# Altium schematic sheet sb-sonata-debug.SchDoc: FTDI Interface (Debug Programming)
size Letter; Organization: NewAE Technology Inc.; Address1: 1083 Queen St., Suite 196; Address2: Halifax; Address3: NS; Address4: Canada B3H 0B2; SheetNumber: 7; SheetTotal: 20; SheetApproved: NO
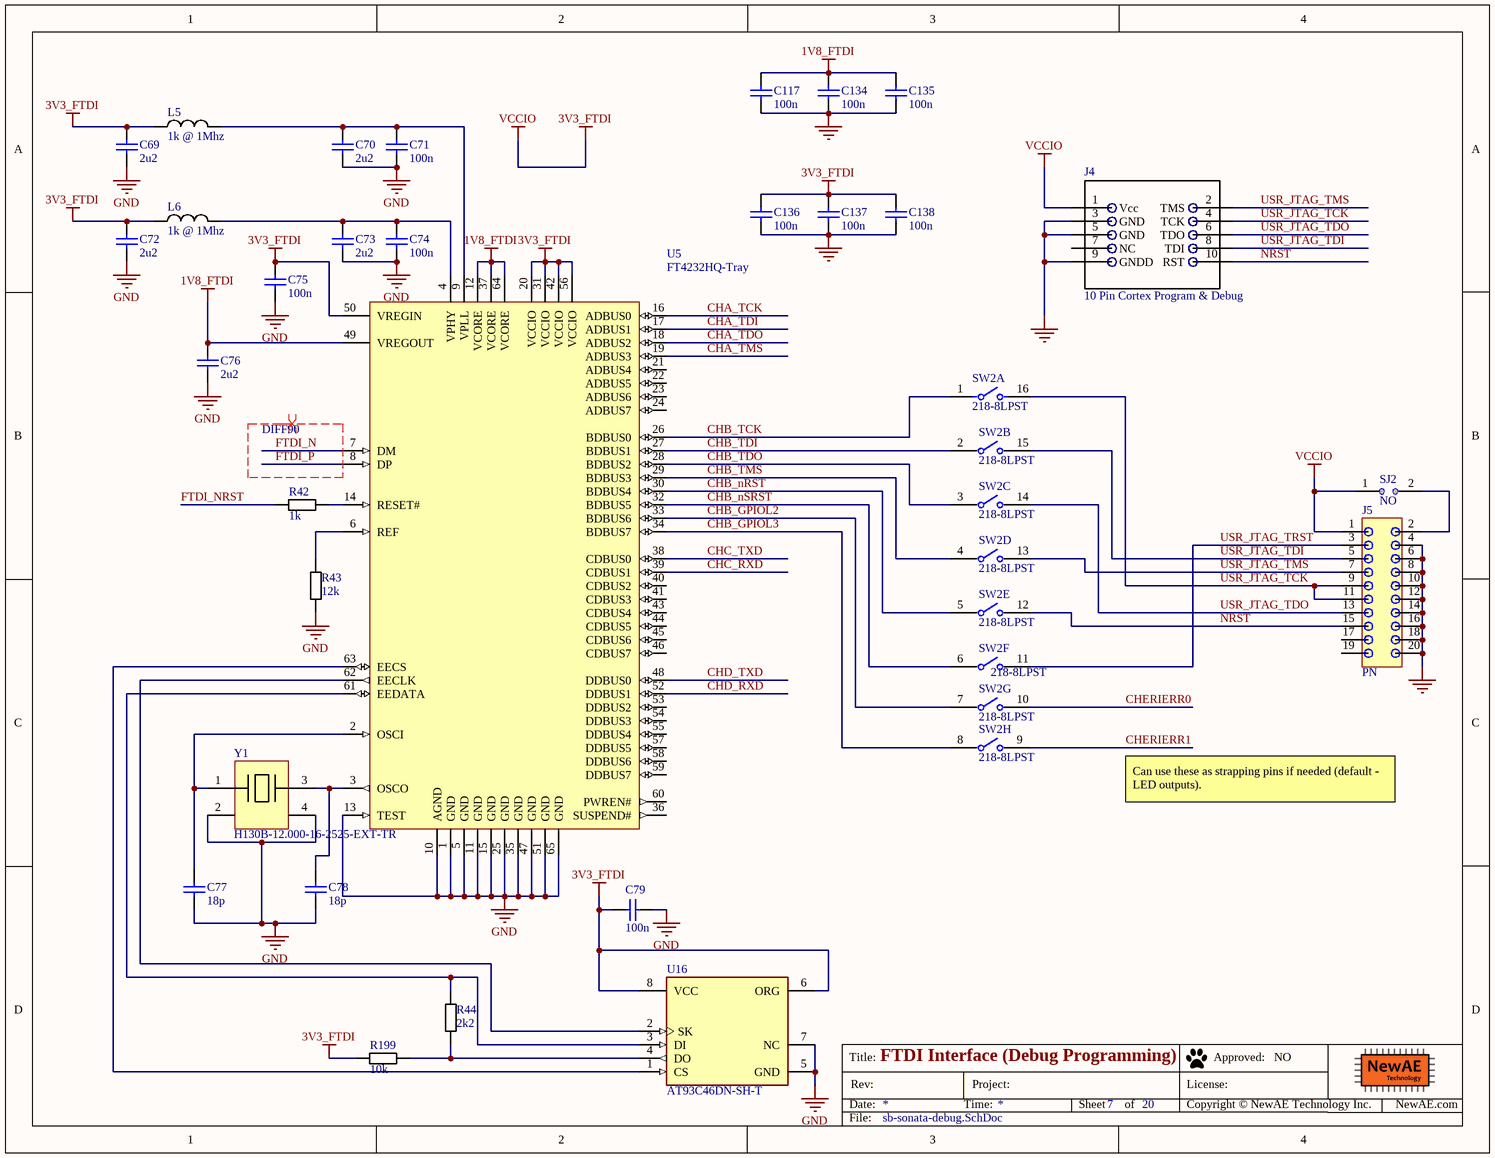
[diagram p0: sb-sonata-debug.SchDoc]

## Parts
C69  2u2  [CAPC0603_M]
C70  2u2  [CAPC0603_M]
C71  100n  [CAPC0402_M]
C72  2u2  [CAPC0603_M]
C73  2u2  [CAPC0603_M]
C74  100n  [CAPC0402_M]
C75  100n  [CAPC0402_M]
C76  2u2  [CAPC0603_M]
C77  18p  [CAPC0402_M]
C78  18p  [CAPC0402_M]
C79  100n  [CAPC0402_M]
C117  100n  [CAPC0402_M]
C134  100n  [CAPC0402_M]
C135  100n  [CAPC0402_M]
C136  100n  [CAPC0402_M]
C137  100n  [CAPC0402_M]
C138  100n  [CAPC0402_M]
J4  10 Pin Cortex Program & Debug  [0.5mm_SMD_Header_5x2]
J5  PN  [CONN_10x2_SHROUDED_2.54mm]
L5  1k @ 1Mhz  [IND_0603]
L6  1k @ 1Mhz  [IND_0603]
R42  1k  [RESC1005X40N]
R43  12k  [RESC1608X55N]
R44  2k2  [RESC1005X40N]
R199  10k  [RESC1005X40N]
SJ2  NO  [SJ_2S_NO]  (no BOM)
SW2  218-8LPST  [FP-218-8LPST-MFG]  (parts A,B,C,D,E,F,G,H of 8)
U5  FT4232HQ-Tray  [QFN64_2_N]
U16  AT93C46DN-SH-T  [FP-C04-057-SN-MFG]
Y1  H130B-12.000-16-2525-EXT-TR  [5x3.2MM XTAL]

## Nets
1V8_FTDI: C76.1 C117.1 C134.1 C135.1 U5.12(VCORE) U5.37(VCORE) U5.49(VREGOUT) U5.64(VCORE)
3V3_FTDI: C69.1 C72.1 C75.1 C79.1 C136.1 C137.1 C138.1 J4.1(Vcc) J5.1 L5.1 L6.1 R199.1 SJ2.1 U5.20(VCCIO) U5.31(VCCIO) U5.42(VCCIO) U5.50(VREGIN) U5.56(VCCIO) U16.6(ORG) U16.8(VCC)  [also labelled VCCIO]
GND: C69.2 C70.2 C71.2 C72.2 C73.2 C74.2 C75.2 C76.2 C77.2 C78.2 C79.2 C117.2 C134.2 C135.2 C136.2 C137.2 C138.2 J4.3(GND) J4.5(GND) J4.9(GNDD) J5.4 J5.6 J5.8 J5.10 J5.12 J5.14 J5.16 J5.18 J5.20 R43.2 U5.1(GND) U5.5(GND) U5.10(AGND) U5.11(GND) U5.13(TEST) U5.15(GND) U5.25(GND) U5.35(GND) U5.47(GND) U5.51(GND) U5.65(GND) U16.5(GND) U16.7(NC) Y1.2 Y1.4
CHA_TCK: U5.16(ADBUS0)
CHA_TDI: U5.17(ADBUS1)
CHA_TDO: U5.18(ADBUS2)
CHA_TMS: U5.19(ADBUS3)
CHB_GPIOL2: SW2.7 U5.33(BDBUS6)
CHB_GPIOL3: SW2.8 U5.34(BDBUS7)
CHB_nRST: SW2.5 U5.30(BDBUS4)
CHB_nSRST: SW2.6 U5.32(BDBUS5)
CHB_TCK: SW2.1 U5.26(BDBUS0)
CHB_TDI: SW2.2 U5.27(BDBUS1)
CHB_TDO: SW2.3 U5.28(BDBUS2)
CHB_TMS: SW2.4 U5.29(BDBUS3)
CHC_RXD: U5.39(CDBUS1)
CHC_TXD: U5.38(CDBUS0)
CHD_RXD: U5.52(DDBUS1)
CHD_TXD: U5.48(DDBUS0)
CHERIERR0: SW2.10
CHERIERR1: SW2.9
FTDI_N: U5.7(DM)
FTDI_NRST: R42.2
FTDI_P: U5.8(DP)
NRST: J4.10(RST) J5.15 SW2.12
USR_JTAG_TCK: J4.4(TCK) J5.9 J5.11 SW2.16
USR_JTAG_TDI: J4.8(TDI) J5.5 SW2.15
USR_JTAG_TDO: J4.6(TDO) J5.13 SW2.14
USR_JTAG_TMS: J4.2(TMS) J5.7 SW2.13
USR_JTAG_TRST: J5.3 SW2.11
NetC70_1: C70.1 C71.1 L5.2 U5.9(VPLL)
NetC73_1: C73.1 C74.1 L6.2 U5.4(VPHY)
NetC77_1: C77.1 U5.2(OSCI) Y1.1
NetC78_1: C78.1 U5.3(OSCO) Y1.3
NetJ5_2: J5.2 SJ2.2
NetR42_1: R42.1 U5.14(RESET#)
NetR43_1: R43.1 U5.6(REF)
NetR44_1: R44.1 U5.61(EEDATA) U16.3(DI)
NetR44_2: R44.2 R199.2 U16.4(DO)
NetU5_62: U5.62(EECLK) U16.2(SK)
NetU5_63: U5.63(EECS) U16.1(CS)

Not connected (* = marked no-connect by the designer): J4 7(NC); J5 17(9) 19(9); U5 21(ADBUS4) 22(ADBUS5) 23(ADBUS6) 24(ADBUS7) 36(SUSPEND#) 40(CDBUS2) 41(CDBUS3) 43(CDBUS4) 44(CDBUS5) 45(CDBUS6) 46(CDBUS7) 53(DDBUS2) 54(DDBUS3) 55(DDBUS4) 57(DDBUS5) 58(DDBUS6) 59(DDBUS7) 60(PWREN#)

## Layout directives
differential pair; differential pair class DIFF90: FTDI_N, FTDI_P

## Notes on the sheet
- Can use these as strapping pins if needed (default - LED outputs).
- Title:
- Date:
- Rev:
- Time:
- Project:
- Sheet
- of
- License:
- Copyright © NewAE Technology Inc.
- Approved:
- NewAE.com
- File:

## Library data of the parts
C69 C70 C72 C73 C76 = CCHIP-2u2-0603: 2u2, 0603; Manufacture 1: Samsung; Manufacture Part Number 1: CL10B225KP8NNNC; Component Group: Capacitor; Case-EIA: 0603; Case-Metric: 1608; Rated Voltage: 10VDC; Part Number: CCHIP-2u2-0603; Footprint: 0603; Pin Count: 2; Supplier 1: Digi-Key; Supplier Part Number 1: 1276-1134-1-ND; Value: 2u2; Mounting Technology: SMT; Component Kind: Standard; Component Type: Standard
C71 C74 C75 C79 C117 C134-C138 = CCHIP-100n-0402: 100n, 0402; Manufacture Part Number 1: CGA2B3X7R1V104K050BB; Component Group: Capacitor; Case-EIA: 0402; Part Number: CCHIP-100n-0402; Footprint: 0402; Pin Count: 2; Supplier 1: Digi-Key; Supplier Part Number 1: 445-6901-1-ND; Value: 100n; Mounting Technology: SMT; Component Kind: Standard; Component Type: Standard
C77 C78 = CCHIP-18p-0402: 18p, 0402; Manufacture Part Number 1: GRM1555C1H180JA01D; Component Group: Capacitor; Case-EIA: 0402; Part Number: CCHIP-18p-0402; Footprint: 0402; Pin Count: 2; Supplier 1: Digi-Key; Supplier Part Number 1: 490-5858-1-ND; Value: 18p; Mounting Technology: SMT; Component Kind: Standard; Component Type: Standard
J4 = Cortex_Debug_Header_10Pin: 10 Pin Cortex Program & Debug 0.5mm pitch; Manufacture Part Number 1: 20021121-00010C4LF; Component Group: Connector; PP Material Stack: 0; Part Number: Cortex_Debug_Header_10Pin; Pin Count: 10; Supplier 1: Digi-Key; Supplier Part Number 1: 609-3695-1-ND; Mounting Technology: SMT; RoHS: Yes; Component Kind: Standard; Component Type: Standard; PP Rotation: 0
J5 = CONN20_2ROW: Header, 2-Row, 20-pin, 0.1"; Component Group: Connector; Part Number: CONN20_2ROW; Pin Count: 20; Mounting Technology: SMT; Component Kind: Standard; Component Type: Standard
L5 L6 = FBCHIP-1k-0603: Ferrite Beads HI CUR CHIP BD 0603 1000OHMS 25%; Manufacture 1: Taiyo Yuden; Manufacture Part Number 1: FBMH1608HM102-T / FBMH1608HM102-T / FBMH1608HM102-T / FBMH1608HM102-T; Component Group: Inductor; PP Material Stack: 0; Part Number: FBCHIP-1k-0603; Footprint: 0603; Pin Count: 2; Supplier 1: Mouser; Supplier Part Number 1: 963-FBMH1608HM102-T; Mounting Technology: SMT; RoHS: Yes; Component Kind: Standard; Component Type: Standard; PP Rotation: 0
R42 = RCHIP-1K-0402: 1k res, 0402, 1%, 1/16W; Manufacture 1: Yageo; Manufacture Part Number 1: RC0402FR-071KL; Component Group: Resistor; Case-EIA: 0402; Case-Metric: 1005; Rated Power: 0.063W; Rated Voltage: 75VDC; Part Number: RCHIP-1K-0402; Footprint: 0402; Pin Count: 2; Supplier 1: Digi-Key; Supplier Part Number 1: 311-1.00KLRCT-ND; Value: 1k; Tolerance: 1%; Mounting Technology: SMT; Temperature Range: -55C to 155C; Component Kind: Standard; Component Type: Standard
R43 = RCHIP-12K-0603: 12k res, 0603, 1%, 1/10W; Manufacture 1: Yageo; Manufacture Part Number 1: RC0603FR-0712KL; Component Group: Resistor; Case-EIA: 0603; Case-Metric: 1608; Rated Power: 0.1W; Rated Voltage: 75VDC; Part Number: RCHIP-12K-0603; Footprint: 0603; Pin Count: 2; Supplier 1: Digi-Key; Supplier Part Number 1: 311-12.0KHRCT-ND; Value: 12k; Tolerance: 1%; Mounting Technology: SMT; Temperature Range: -55C to 155C; Component Kind: Standard; Component Type: Standard
R44 = RCHIP-2K2-0402: 2k2 res, 0402, 1%, 1/16W; Manufacture 1: Yageo; Manufacture Part Number 1: RC0402FR-072K2L; Component Group: Resistor; Case-EIA: 0402; Case-Metric: 1005; Rated Power: 0.063W; Rated Voltage: 75VDC; Part Number: RCHIP-2K2-0402; Footprint: 0402; Pin Count: 2; Supplier 1: Digi-Key; Supplier Part Number 1: 311-2.20KLRCT-ND; Value: 2k2; Tolerance: 1%; Mounting Technology: SMT; Temperature Range: -55C to 155C; Component Kind: Standard; Component Type: Standard
R199 = RCHIP-10K-0402: 10k res, 0402, 1%, 1/16W; Manufacture 1: Yageo; Manufacture Part Number 1: RC0402FR-0710KL; Component Group: Resistor; Case-EIA: 0402; Case-Metric: 1005; Rated Power: 0.063W; Rated Voltage: 75VDC; Part Number: RCHIP-10K-0402; Footprint: 0402; Pin Count: 2; Supplier 1: Digi-Key; Supplier Part Number 1: 311-10.0KLRCT-ND; Value: 10k; Tolerance: 1%; Mounting Technology: SMT; Temperature Range: -55C to 155C; Component Kind: Standard; Component Type: Standard
SJ2 = SJ_2S_NO: Solder Jumper, NO; Component Group: PCB Feature; Part Number: SJ_2S_NO; Pin Count: 2; Mounting Technology: COPPER; Component Type: Standard (No BOM)
SW2 = CMP-07018-000007-1: SWITCH SLIDE DIP SPST 25MA 24V; Number of Positions: 8; Pitch: 0.05inch; Actuator Type: Slide (Standard); Electrical Life: 1000Cycles; Washable: Yes; Contact Resistance: 100mR; Radiation Hardening: No; Packaging: Rail/Tube; Length: 0.446inch; Depth: 8.44mm; Max Voltage Rating (DC): 24V; Lead Free: Lead Free; Mount: Surface Mount; RoHS Compliant: Yes; Series: 218; Max Operating Temperature: 85°C; Termination: Gull Wing; Voltage Rating (DC): 24V; Current Rating: 25mA; Contact Plating: Gold; Min Operating Temperature: -55°C; Terminal Pitch: 1.27mm; Contact Material: Copper; Throw Configuration: SPST; Orientation: Straight; Max Current Rating: 25mA; Height: 2.65mm; Package Quantity: 40
U5 = CMP-0078-00002-3: Quad High Speed USB To Multipurpose UART/MPSSE IC, 64-pin QFN, Tray; Manufacturer: FTDI; PackageDescription: 64-Pin Quad Flat No-Lead, 9 x 9 mm Body, 0.5 mm Pitch, 4.35 x 4.35 mm Exposed Pad; PackageVersion: Jan-12; ComponentLink2URL: http://www.ftdichip.com/Support/Documents/DataSheets/ICs/DS_FT4232H.pdf; RevisionNote: DatasheetVersion updated to 2.2 Jan-2012; ComponentLink1Description: Manufacturer URL; DatasheetVersion: ver 2.2, Jan-2012; PackageReference: QFN64_2; ComponentLink2Description: Datasheet; ComponentLink1URL: http://www.ftdichip.com/; PartNumber: FT4232HQ-Tray
U16 = CMP-06313-000016-1: IC EEPROM 1K SPI 2MHZ 8SOIC; Manufacturer: Microchip; Nominal Supply Current: 0.5mA; Memory Size: 1Kbits; Access Time: 1000ns; Max Supply Voltage: 5.5V; Interface: Other; Standoff Height: 0.1mm; Min Supply Voltage: 1.8V; Category: IC; Temperature Range High: +85°C; Mouser Description: EEPROM Serial-3Wire 1K-Bit 128 x 8/64 x 16 2.5V/3.3V/5V 8-Pin SOIC T/R; Ipc Land Pattern Name: SOIC127P600X175-8; Temperature Range Low: -40°C; Temperature: -40°C to +85°C; Digikey Description: IC EEPROM 1K SPI 2MHZ 8SOIC; Lead Free: Yes; Device Class L2: Memory; ComponentLink2URL: http://ww1.microchip.com/downloads/en/DeviceDoc/20006224B.pdf; Automotive: No; Device Class L3: EEPROM; Package: C04-057-SN; Octopart: https://octopart.com/at93c46dn-sh-t-microchip-77759177; RoHS: TRUE; Memory Type: EEPROM; Height: 1.75mm; Manufacturer Part Number: AT93C46DN-SH-T; ComponentLink2Description: Datasheet; Frequency: 2MHz; Device Class L1: Integrated Circuits (ICs)
Y1 = H130B-12.000-16-2525-EXT-TR: 12MHz ±25ppm Crystal 16pF 35 Ohms 4-SMD, No Lead; Manufacture 1: Raltron Electronics; Value: 12.000MHz; PP Material Stack: 0; Supplier 1: Digi-Key; Stock 1: 4955; Pricing 1: 1=0.590000, 10=0.488000, 50=0.439400, 100=0.390600, 500=0.371100 (USD); Supplier Part Number 1: 2151-H130B-12.000-16-2525-EXT-TR-ND; .Checked SCH: *; .Checked PCB: *; Manufacturer Part Number: H130B-12.000-16-2525-EXT-TR; Part Number: H130B-12.000-16-2525-EXT-TR; Component Group: Crystal; Footprint: 5x3.2mm; Manufacture Part Number 1: H130B-12.000-16-2525-EXT-TR; Pin Count: 4; Mounting Technology: SMT; Component Kind: Standard; Component Type: Standard; PP Rotation: 0